# Altium schematic sheet Sheet1.SchDoc: HI
size C; Author: *MR.K; SheetNumber: 1; SheetTotal: 1; Time: HI
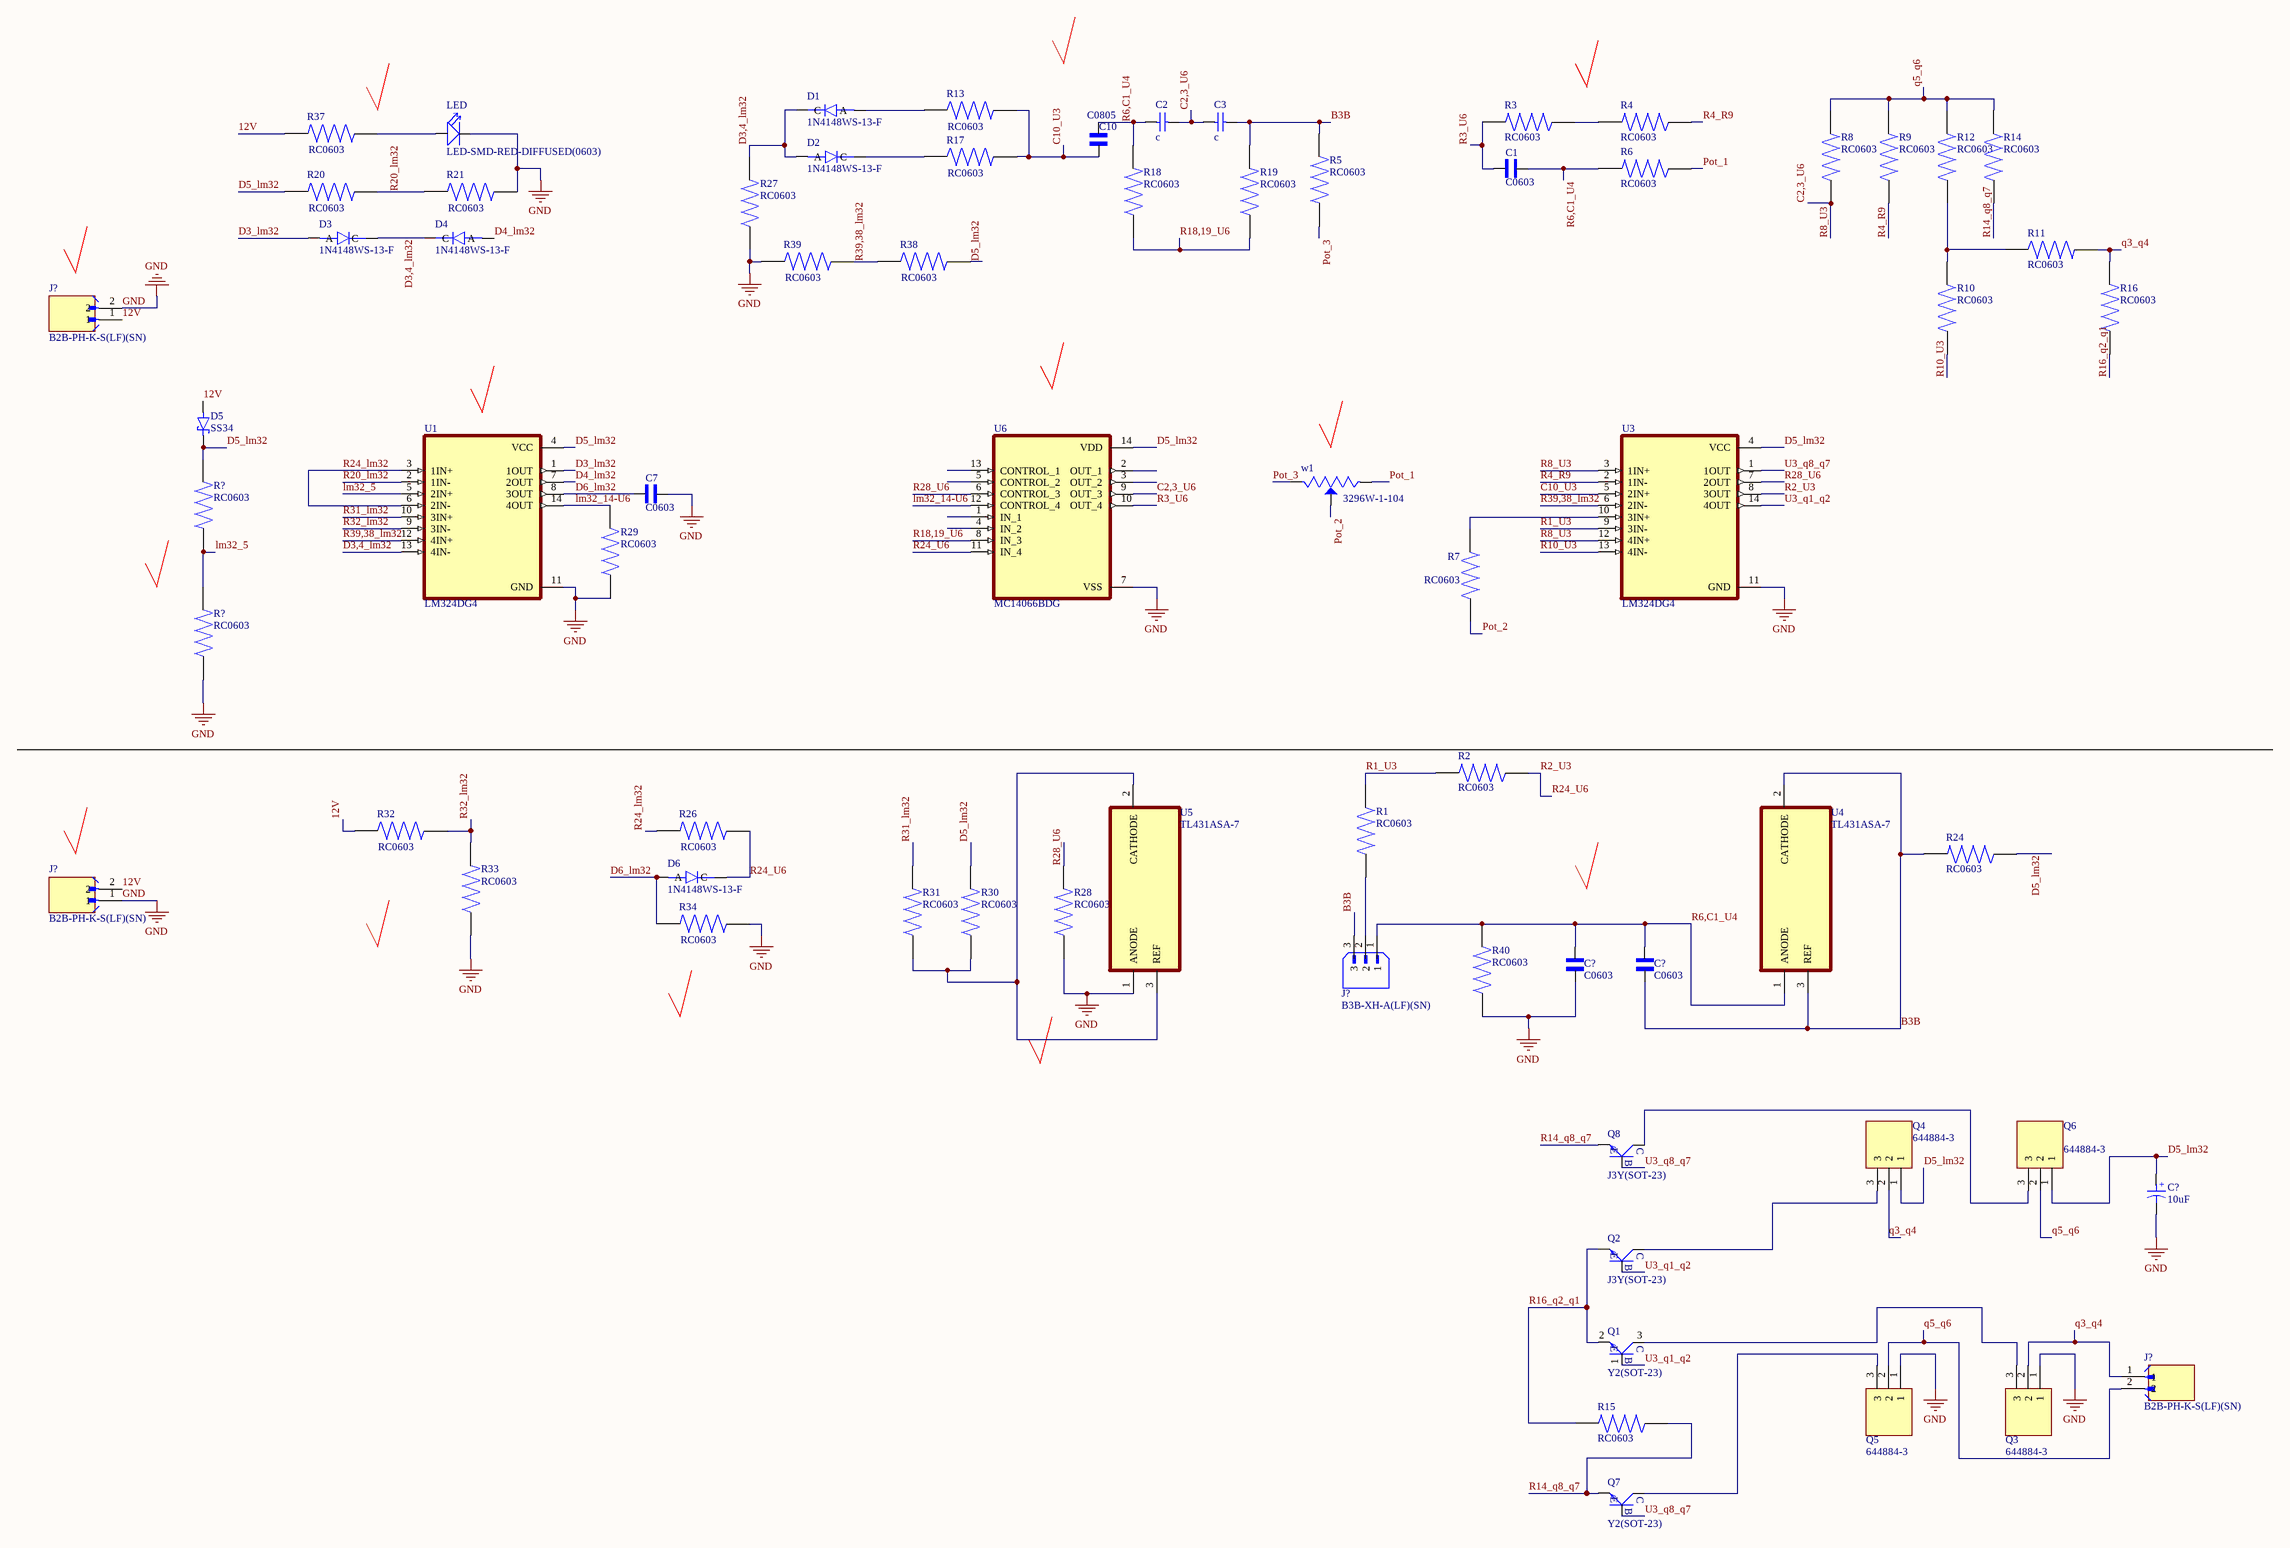
[diagram p0: Sheet1.SchDoc]

## Parts
(Parts that share a designator on the sheet are numbered #1, #2 ... from top to bottom, then left to right.)
C1  C0603  [CAPC1608X90]
C2  c  [CAP1206]
C3  c  [CAP1206]
C7  C0603  [CAPC1608X90]
C10  C0805  [CAPC2012X88N]
C?#1  C0603  [CAPC1608X90]
C?#2  C0603  [CAPC1608X90]
C?#3  10uF  [Cap electrolitic radial 8x14-3.5]
D1  1N4148WS-13-F  [SOD2513X120N]
D2  1N4148WS-13-F  [SOD2513X120N]
D3  1N4148WS-13-F  [SOD2513X120N]
D4  1N4148WS-13-F  [SOD2513X120N]
D5  SS34  [DIOM7959X265N]
D6  1N4148WS-13-F  [SOD2513X120N]
J?#1  B2B-PH-K-S(LF)(SN)  [JST_B2B-PH-K-S(LF)(SN)]
J?#2  B2B-PH-K-S(LF)(SN)  [JST_B2B-PH-K-S(LF)(SN)]
J?#3  B3B-XH-A(LF)(SN)  [JST_B3B-XH-A(LF)(SN)]
J?#4  B2B-PH-K-S(LF)(SN)  [JST_B2B-PH-K-S(LF)(SN)]
LED  LED-SMD-RED-DIFFUSED(0603)  [LED-0603]
Q1  Y2(SOT-23)  [SOT-23]
Q2  J3Y(SOT-23)  [SOT-23]
Q3  644884-3  [TE_644884-3]
Q4  644884-3  [TE_644884-3]
Q5  644884-3  [TE_644884-3]
Q6  644884-3  [TE_644884-3]
Q7  Y2(SOT-23)  [SOT-23]
Q8  J3Y(SOT-23)  [SOT-23]
R1  RC0603  [RESC1607X60N]
R2  RC0603  [RESC1607X60N]
R3  RC0603  [RESC1607X60N]
R4  RC0603  [RESC1607X60N]
R5  RC0603  [RESC1607X60N]
R6  RC0603  [RESC1607X60N]
R7  RC0603  [RESC1607X60N]
R8  RC0603  [RESC1607X60N]
R9  RC0603  [RESC1607X60N]
R10  RC0603  [RESC1607X60N]
R11  RC0603  [RESC1607X60N]
R12  RC0603  [RESC1607X60N]
R13  RC0603  [RESC1607X60N]
R14  RC0603  [RESC1607X60N]
R15  RC0603  [RESC1607X60N]
R16  RC0603  [RESC1607X60N]
R17  RC0603  [RESC1607X60N]
R18  RC0603  [RESC1607X60N]
R19  RC0603  [RESC1607X60N]
R20  RC0603  [RESC1607X60N]
R21  RC0603  [RESC1607X60N]
R24  RC0603  [RESC1607X60N]
R26  RC0603  [RESC1607X60N]
R27  RC0603  [RESC1607X60N]
R28  RC0603  [RESC1607X60N]
R29  RC0603  [RESC1607X60N]
R30  RC0603  [RESC1607X60N]
R31  RC0603  [RESC1607X60N]
R32  RC0603  [RESC1607X60N]
R33  RC0603  [RESC1607X60N]
R34  RC0603  [RESC1607X60N]
R37  RC0603  [RESC1607X60N]
R38  RC0603  [RESC1607X60N]
R39  RC0603  [RESC1607X60N]
R40  RC0603  [RESC1607X60N]
R?#1  RC0603  [RESC1607X60N]
R?#2  RC0603  [RESC1607X60N]
U1  LM324DG4  [SOIC127P600X175-14N]
U3  LM324DG4  [SOIC127P600X175-14N]
U4  TL431ASA-7  [SOT95P240X135-3N]
U5  TL431ASA-7  [SOT95P240X135-3N]
U6  MC14066BDG  [SOIC127P600X175-14N]
w1  3296W-1-104  [TRIM_3296W-1-104]

## Nets
GND: C7.1 C?#1.2 C?#3.2 J?#1.2 J?#2.1 LED.NEG Q3.1 Q5.1 R21.2 R27.1 R28.1 R29.1 R33.1 R34.2 R39.1 R40.1 R?#2.1 U1.11(GND) U3.11(GND) U5.1(ANODE) U6.7(VSS)
12V: D5.A J?#1.1 J?#2.2 R32.1 R37.1
B3B: C3.1 C?#2.2 J?#3.3 R5.2 R19.2 R24.2 U4.2(CATHODE) U4.3(REF)
C2,3_U6: C2.1 C3.2 R8.2 U3.3(1IN+) U3.12(4IN+) U6.9(OUT_3)  [also labelled R8_U3]
C10_U3: C10.2 R13.2 R17.2 U3.5(2IN+)
D3,4_lm32: D1.C D2.A D3.C D4.C R27.2 U1.13(4IN-)
D3_lm32: D3.A U1.1(1OUT)
D4_lm32: D4.A U1.7(2OUT)
D5_lm32: C?#3.1 D5.C(K) Q4.1 Q6.1 R20.1 R24.1 R30.2 R38.2 R?#1.2 U1.4(VCC) U3.4(VCC) U6.14(VDD)
D6_lm32: C7.2 D6.A R34.1 U1.8(3OUT)
lm32_5: R?#1.1 R?#2.2 U1.5(2IN+)
lm32_14-U6: R29.2 U1.14(4OUT) U6.12(CONTROL_4)
Pot_1: R6.1 w1.1(CCW)
Pot_2: R7.2 w1.2(WIPER)
Pot_3: R5.1 w1.3(CW)
q3_q4: J?#4.1 Q3.2 Q4.2 R11.2 R16.2
q5_q6: J?#4.2 Q5.2 Q6.2 R8.1 R9.1 R12.1 R14.1
R1_U3: R1.1 R2.2 U3.9(3IN-)
R3_U6: C1.2 R3.2 U6.10(OUT_4)
R4_R9: R4.1 R9.2 U3.2(1IN-)
R6,C1_U4: C1.1 C2.2 C10.1 C?#1.1 C?#2.1 J?#3.1 R6.2 R18.2 R40.2 U4.1(ANODE)
R10_U3: R10.2 U3.13(4IN-)
R14_q8_q7: Q7.2(E) Q8.2(E) R14.2 R15.1
R16_q2_q1: Q1.2(E) Q2.2(E) R15.2 R16.1
R18,19_U6: R18.1 R19.1 U6.8(IN_3)
R20_lm32: R20.2 R21.1 U1.2(1IN-)
R24_lm32: R26.1 U1.3(1IN+) U1.6(2IN-)
R24_U6: D6.C R2.1 R26.2 U3.8(3OUT) U6.11(IN_4)  [also labelled R2_U3]
R28_U6: R28.2 U3.7(2OUT) U6.6(CONTROL_3)
R31_lm32: R31.2 U1.10(3IN+)
R32_lm32: R32.2 R33.2 U1.9(3IN-)
R39,38_lm32: R38.1 R39.2 U1.12(4IN+) U3.6(2IN-)
U3_q1_q2: Q1.1(B) Q2.1(B) U3.14(4OUT)
U3_q8_q7: Q7.1(B) Q8.1(B) U3.1(1OUT)
NetD1_A: D1.A R13.1
NetD2_C: D2.C R17.1
NetJ?#3_2: J?#3.2 R1.2
NetLED_POS: LED.POS R37.2
NetQ1_3: Q1.3(C) Q3.3
NetQ2_3: Q2.3(C) Q4.3
NetQ5_3: Q5.3 Q7.3(C)
NetQ6_3: Q6.3 Q8.3(C)
NetR3_1: R3.1 R4.2
NetR7_1: R7.1 U3.10(3IN+)
NetR10_1: R10.1 R11.1 R12.2
NetR30_1: R30.1 R31.1 U5.2(CATHODE) U5.3(REF)

Not connected (* = marked no-connect by the designer): U6 1(IN_1) 2(OUT_1) 3(OUT_2) 4(IN_2) 5(CONTROL_2) 13(CONTROL_1)

## Notes on the sheet
- (in symbol Cap electrolitic radial 8x14-3.5) +

## Library data of the parts
C1 C7 C?#1 C?#2 = C0603C104K3RACTU: Capacitor;Ceramic;Cap;.100uF;Tol 10%;SMT;Vol-Rtg 25V;X7R;Cut Tape | KEMET C0603C104K3RACTU; SnapEDA_Link: https://www.snapeda.com/parts/C0603C104K3RACTU/KEMET/view-part/?ref=snap; Package: 603-2 KEMET; Value: *; MF: KEMET; MP: C0603C104K3RACTU; Check_prices: https://www.snapeda.com/parts/C0603C104K3RACTU/KEMET/view-part/?ref=eda
C2 C3 = CAP1206
C10 = C0805C106K4PACTU: 10 ÂµF Â±10% 16V Ceramic Capacitor X5R 0805 (2012 Metric); MF: KEMET; SnapEDA_Link: https://www.snapeda.com/parts/C0805C106K4PACTU/KEMET/view-part/?ref=snap; Package: 0805 Kemet; Value: *; MP: C0805C106K4PACTU; Check_prices: https://www.snapeda.com/parts/C0805C106K4PACTU/KEMET/view-part/?ref=eda
C?#3 = Cap electrolitic radial 8x14-3.5
D1-D4 D6 = 1N4148WS-13-F: Diode Standard 75 V 150mA Surface Mount SOD-323; MF: Diodes Inc.; SnapEDA_Link: https://www.snapeda.com/parts/1N4148WS-13-F/Diodes+Inc./view-part/?ref=snap; Package: SOD-323 Diodes Inc.; Value: *; MP: 1N4148WS-13-F; Check_prices: https://www.snapeda.com/parts/1N4148WS-13-F/Diodes+Inc./view-part/?ref=eda
D5 = SS34: Diode Schottky 40 V 3A Surface Mount SMC (DO-214AB); MF: onsemi; SnapEDA_Link: https://www.snapeda.com/parts/SS34/Onsemi/view-part/?ref=snap; Package: SMC-2 ON Semiconductor; Value: *; MP: SS34; Check_prices: https://www.snapeda.com/parts/SS34/Onsemi/view-part/?ref=eda
J?#1 J?#2 J?#4 = B2B-PH-K-S(LF)(SN): Connector Header Through Hole 2 position 0.079 (2.00mm); MF: JST; SnapEDA_Link: https://www.snapeda.com/parts/B2B-PH-K-S%20(LF)(SN)/JST/view-part/?ref=snap; Package: None; Value: *; MP: B2B-PH-K-S (LF)(SN); Check_prices: https://www.snapeda.com/parts/B2B-PH-K-S%20(LF)(SN)/JST/view-part/?ref=eda
J?#3 = B3B-XH-A(LF)(SN): Connector Header Through Hole 3 position 0.098 (2.50mm); MF: JST Sales; SnapEDA_Link: https://www.snapeda.com/parts/B3B-XH-A(LF)(SN)/JST/view-part/?ref=snap; Package: None; Value: *; MP: B3B-XH-A(LF)(SN); Check_prices: https://www.snapeda.com/parts/B3B-XH-A(LF)(SN)/JST/view-part/?ref=eda
LED = LED-SMD-RED-DIFFUSED(0603): Red - LED Indication - Discrete 1.95V 0603 (1608 Metric); MF: Everlight Electronics; MP: 19-217/R6C-AL1M2VY/3T; SnapEDA_Link: https://www.snapeda.com/parts/19-217/R6C-AL1M2VY/3T/Everlight/view-part/?ref=snap; Package: 0603 Everlight Electronics; Value: *; Check_prices: https://www.snapeda.com/parts/19-217/R6C-AL1M2VY/3T/Everlight/view-part/?ref=eda
Q1 Q2 Q7 Q8 = SMD-TRANSISTORS-NPN-25V-500MW(SOT-23): Bipolar (BJT) Transistor NPN 25 V 500 mA 150MHz 300 mW Surface Mount SOT-23; MF: UMW; MP: S8050; Purchase-URL: https://pricing.snapeda.com/search/part/S8050/?ref=eda; Check_prices: https://www.snapeda.com/parts/S8050/Umwelt+Sensor+Teknik/view-part/?ref=eda; SnapEDA_Link: https://www.snapeda.com/parts/S8050/Umwelt+Sensor+Teknik/view-part/?ref=snap; Price: None; Availability: In Stock; Package: None; Value: *
Q3-Q6 = 644884-3: Conn Unshrouded Header HDR 3 POS 2.54mm Solder ST Thru-Hole Bag/Box; MF: TE Connectivity; SnapEDA_Link: https://www.snapeda.com/parts/644884-3/TE+Connectivity+AMP+Connectors/view-part/?ref=snap; Package: None; Value: *; MP: 644884-3; EU_RoHS_Compliance: Compliant; Check_prices: https://www.snapeda.com/parts/644884-3/TE+Connectivity+AMP+Connectors/view-part/?ref=eda
R1-R21 R24 R26-R34 R37-R40 R?#1 R?#2 = RC0603JR-070RL: 0 Ohms Jumper 0.1W, 1/10W Chip Resistor 0603 (1608 Metric) Moisture Resistant Thick Film; MF: Yageo; SnapEDA_Link: https://www.snapeda.com/parts/RC0603JR-070RL/Yageo/view-part/?ref=snap; Package: 0603 Yageo; Value: *; MP: RC0603JR-070RL; Check_prices: https://www.snapeda.com/parts/RC0603JR-070RL/Yageo/view-part/?ref=eda
U1 U3 = LM324DG4: 4-Channel industry standard operational amplifier 14-SOIC 0 to 70; MF: Texas Instruments; SnapEDA_Link: https://www.snapeda.com/parts/LM324DG4/Texas+Instruments/view-part/?ref=snap; Package: SOIC-14 Texas Instruments; Value: *; MP: LM324DG4; Check_prices: https://www.snapeda.com/parts/LM324DG4/Texas+Instruments/view-part/?ref=eda
U4 U5 = TL431ASA-7: Shunt Voltage Reference IC Adjustable 2.495V 36 VV Â±1% 100 mA SOT-23-3; MF: Diodes Inc.; SnapEDA_Link: https://www.snapeda.com/parts/TL431ASA-7/Diodes+Inc./view-part/?ref=snap; Package: SOT-23-3 Diodes Inc.; Value: *; MP: TL431ASA-7; Check_prices: https://www.snapeda.com/parts/TL431ASA-7/Diodes+Inc./view-part/?ref=eda
U6 = MC14066BDG: MC14066BDG, Analogue Switch Quad SPST, 12 V, 15 V, 5 V, 9 V, 14-Pin SOIC | ON Semiconductor MC14066BDG; SnapEDA_Link: https://www.snapeda.com/parts/MC14066BDG/Onsemi/view-part/?ref=snap; Package: SOIC-14 ON Semiconductor; Value: *; MF: ON Semiconductor; MP: MC14066BDG; Check_prices: https://www.snapeda.com/parts/MC14066BDG/Onsemi/view-part/?ref=eda
w1 = 3296W-1-104: TRIMMER - 3/8in SQ MT CERMET | Bourns 3296W-1-104; SnapEDA_Link: https://www.snapeda.com/parts/3296W-1-104/Bourns/view-part/?ref=snap; Package: NON STANDARD-3 Bourns; Value: *; MF: Bourns; MP: 3296W-1-104; Check_prices: https://www.snapeda.com/parts/3296W-1-104/Bourns/view-part/?ref=eda